# EAGLE schematic PLT-01-RevD (EAGLE 9.6.2)
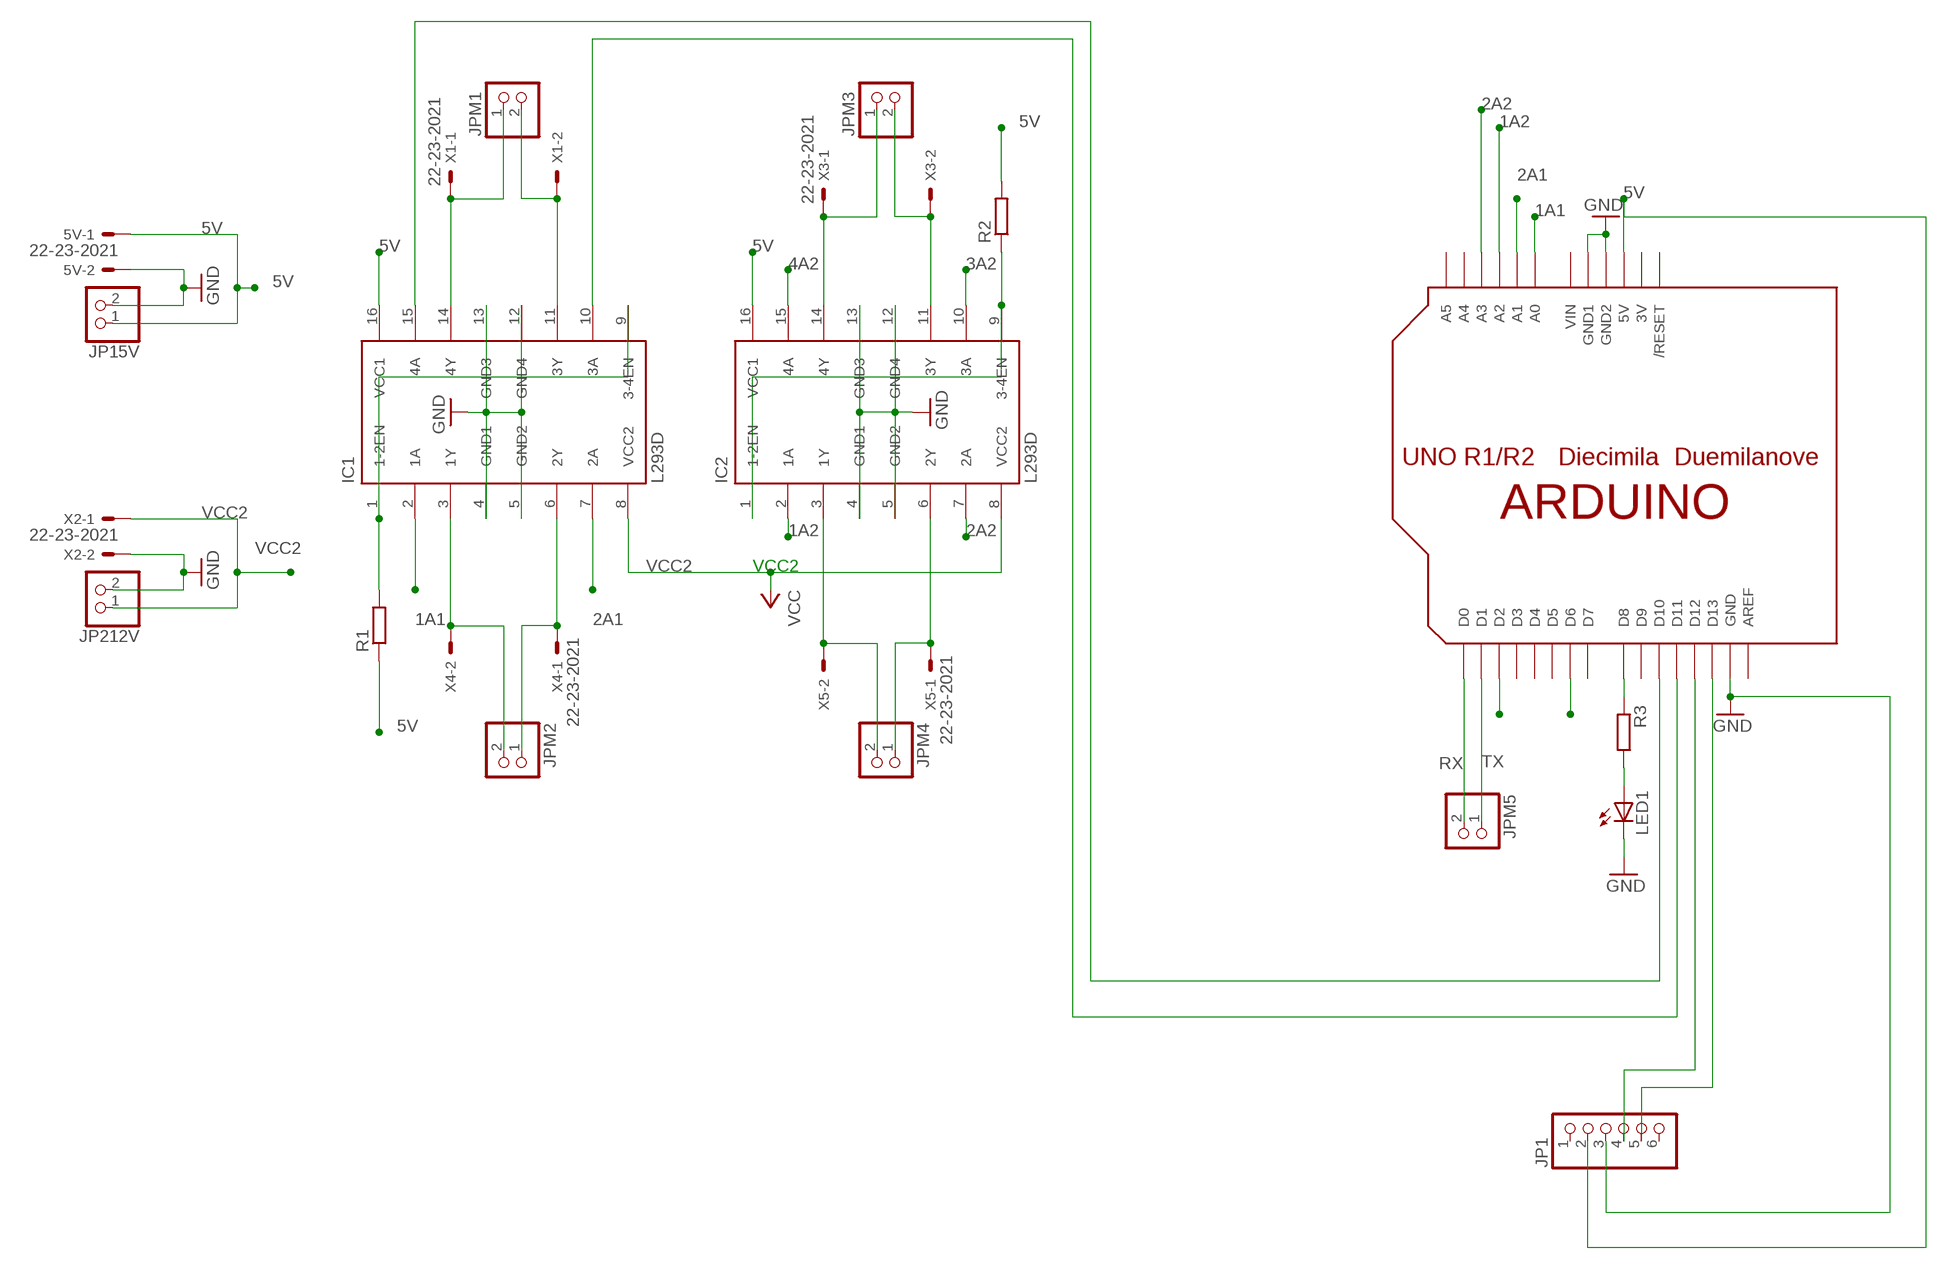
[diagram p0: schematic, sheet 1]

## Parts
5V  22-23-2021  [22-23-2021]
IC1  L293D  [DIL16]
IC2  L293D  [DIL16]
JP1  PINHD-1X6  [1X06]
JP15V  PINHD-1X2  [1X02]
JP212V  PINHD-1X2  [1X02]
JPM1  PINHD-1X2  [1X02]
JPM2  PINHD-1X2  [1X02]
JPM3  PINHD-1X2  [1X02]
JPM4  PINHD-1X2  [1X02]
JPM5  PINHD-1X2  [1X02]
LED1  LED5MM  [LED5MM]
R1  R-EU_0207/10  [0207/10]
R2  R-EU_0207/10  [0207/10]
R3  R-EU_0207/10  [0207/10]
U$1  ARDUINOUNO  [ARDUINO]
X1  22-23-2021  [22-23-2021]
X2  22-23-2021  [22-23-2021]
X3  22-23-2021  [22-23-2021]
X4  22-23-2021  [22-23-2021]
X5  22-23-2021  [22-23-2021]

## Nets
1A1: IC1.2(1A) U$1.A0
1A2: IC2.2(1A) U$1.A2
2A1: IC1.7(2A) U$1.A1
2A2: IC2.7(2A) U$1.A3
3A2: IC2.10(3A) U$1.D2
4A2: IC2.15(4A) U$1.D6
5V: 5V.1 IC1.16(VCC1) IC2.16(VCC1) JP1.2 JP15V.1 R1.1 R2.2 U$1.5V
GND: 5V.2 IC1.4(GND1) IC1.5(GND2) IC1.12(GND4) IC1.13(GND3) IC2.4(GND1) IC2.5(GND2) IC2.12(GND4) IC2.13(GND3) JP1.3 JP15V.2 JP212V.2 LED1.K(C) U$1.GND U$1.GND1 U$1.GND2 X2.2
N$1: IC1.3(1Y) JPM2.2 X4.2
N$2: IC1.6(2Y) JPM2.1 X4.1
N$3: IC2.3(1Y) JPM4.2 X5.2
N$4: IC2.6(2Y) JPM4.1 X5.1
N$5: IC2.14(4Y) JPM3.1 X3.1
N$6: IC2.11(3Y) JPM3.2 X3.2
N$7: IC1.14(4Y) JPM1.1 X1.1
N$8: IC1.11(3Y) JPM1.2 X1.2
N$9: IC2.1(1-2EN) IC2.9(3-4EN) R2.1
N$10: R3.1 U$1.D8
N$11: IC1.10(3A) U$1.D11
N$12: LED1.A R3.2
N$13: JP1.4 U$1.D12
N$14: IC1.1(1-2EN) IC1.9(3-4EN) R1.2
N$19: JP1.5 U$1.D13
N$22: IC1.15(4A) U$1.D10
RX: JPM5.2 U$1.D0
TX: JPM5.1 U$1.D1
VCC2: IC1.8(VCC2) IC2.8(VCC2) JP212V.1 X2.1 ; supply symbol labelled VCC
Unconnected: JP1.1 JP1.6 U$1.A4 U$1.A5 U$1.AREF U$1.D3 U$1.D4 U$1.D5 U$1.D7 U$1.D9 U$1.RESET(/RESET)

## Notes on the sheet
- VCC2

## Power pins joined to a net without a drawn wire
3V: U$1.3V
VIN: U$1.VIN

## Library data of the parts
5V X1-X5 = con-molex:22-23-2021: .100" (2.54mm) Center Header - 2 Pin; MF: MOLEX; MPN: 22-23-2021; OC_FARNELL: 1462926; OC_NEWARK: 25C3832
IC1 IC2 = st-microelectronics:L293D: PUSH-PULL 4 CHANNEL DRIVER; MPN: L293D; OC_FARNELL: 9589619; OC_NEWARK: 56P8249
JP1 = pinhead:PINHD-1X6: PIN HEADER
JP15V JP212V JPM1-JPM5 = pinhead:PINHD-1X2: PIN HEADER
LED1 = led:LED: LED OSRAM: - CHIPLED LG R971, LG N971, LY N971, LG Q971, LY Q971, LO R971, LY R971 LH N974, LH R974 LS Q976, LO Q976, LY Q976 LO Q996 - Hyper CHIPLED LW Q18S LB Q993, LB Q99A, LB R99A - SideLED LS A670, LO A670, LY A670, LG A670, LP A670 LB A673, LV A673, LT A673, LW A673 LH A674 LY A675 LS A676, LA A676, LO A676, LY A676, LW A676 LS A679, LY A679, LG A679 - Hyper Micro SIDELED® LS Y876, LA Y876, LO Y876, LY Y876 LT Y87S - SmartLED LW L88C, LW L88S LB L89C, LB L89S, LG L890 LS L89K, LO L89K, LY L89K LS L896, LA L896, LO L896, LY L896 - TOPLED LS T670, LO T670, LY T670, LG T670, LP T670 LSG T670, LSP T670, LSY T670, LOP T670, LYG T670 LG T671, LOG T671, LSG T671 LB T673, LV T673, LT T673, LW T673 LH T674 LS T676, LA T676, LO T676, LY T676, LB T676, LH T676, LSB T676, LW T676 LB T67C, LV T67C, LT T67C, LS T67K, LO T67K, LY T67K, LW E67C LS E67B, LA E67B, LO E67B, LY E67B, LB E67C, LV E67C, LT E67C LW T67C LS T679, LY T679, LG T679 LS T770, LO T770, LY T770, LG T770, LP T770 LB T773, LV T773, LT T773, LW T773 LH T774 LS E675, LA E675, LY E675, LS T675 LS T776, LA T776, LO T776, LY T776, LB T776 LHGB T686 LT T68C, LB T68C - Hyper Mini TOPLED® LB M676 - Mini TOPLED Santana® LG M470 LS M47K, LO M47K, LY M47K Source: http://www.osram.convergy.de LUXEON: - LUMILED® LXK2-PW12-R00, LXK2-PW12-S00, LXK2-PW14-U00, LXK2-PW14-V00 LXK2-PM12-R00, LXK2-PM12-S00, LXK2-PM14-U00 LXK2-PE12-Q00, LXK2-PE12-R00, LXK2-PE12-S00, LXK2-PE14-T00, LXK2-PE14-U00 LXK2-PB12-K00, LXK2-PB12-L00, LXK2-PB12-M00, LXK2-PB14-N00, LXK2-PB14-P00, LXK2-PB14-Q00 LXK2-PR12-L00, LXK2-PR12-M00, LXK2-PR14-Q00, LXK2-PR14-R00 LXK2-PD12-Q00, LXK2-PD12-R00, LXK2-PD12-S00 LXK2-PH12-R00, LXK2-PH12-S00 LXK2-PL12-P00, LXK2-PL12-Q00, LXK2-PL12-R00 Source: www.luxeon.com KINGBRIGHT: KA-3528ASYC Source: www.kingbright.com
R1-R3 = resistor:R-EU_: RESISTOR, European symbol
U$1 = adafruit:ARDUINO: Arduino Diecimila/Duemilanove Make a shield with ease, this package has all the named pins as well as the two mounting drill holes and an outline of the USB and DC power connector. The outline is on the DIMENSION layer, so if your board house uses it they will cut the outline to match. http://www.ladyada.net/library/pcb/eaglelibrary.html